# EasyEDA schematic SchematicsEASYEDA.json
TITLE: FLOOD SCHEMATICS; REV: 1.0; Date: 2024-03-15; Sheet: 1/1; Company: THE OHIO STATE UNIVERSITY
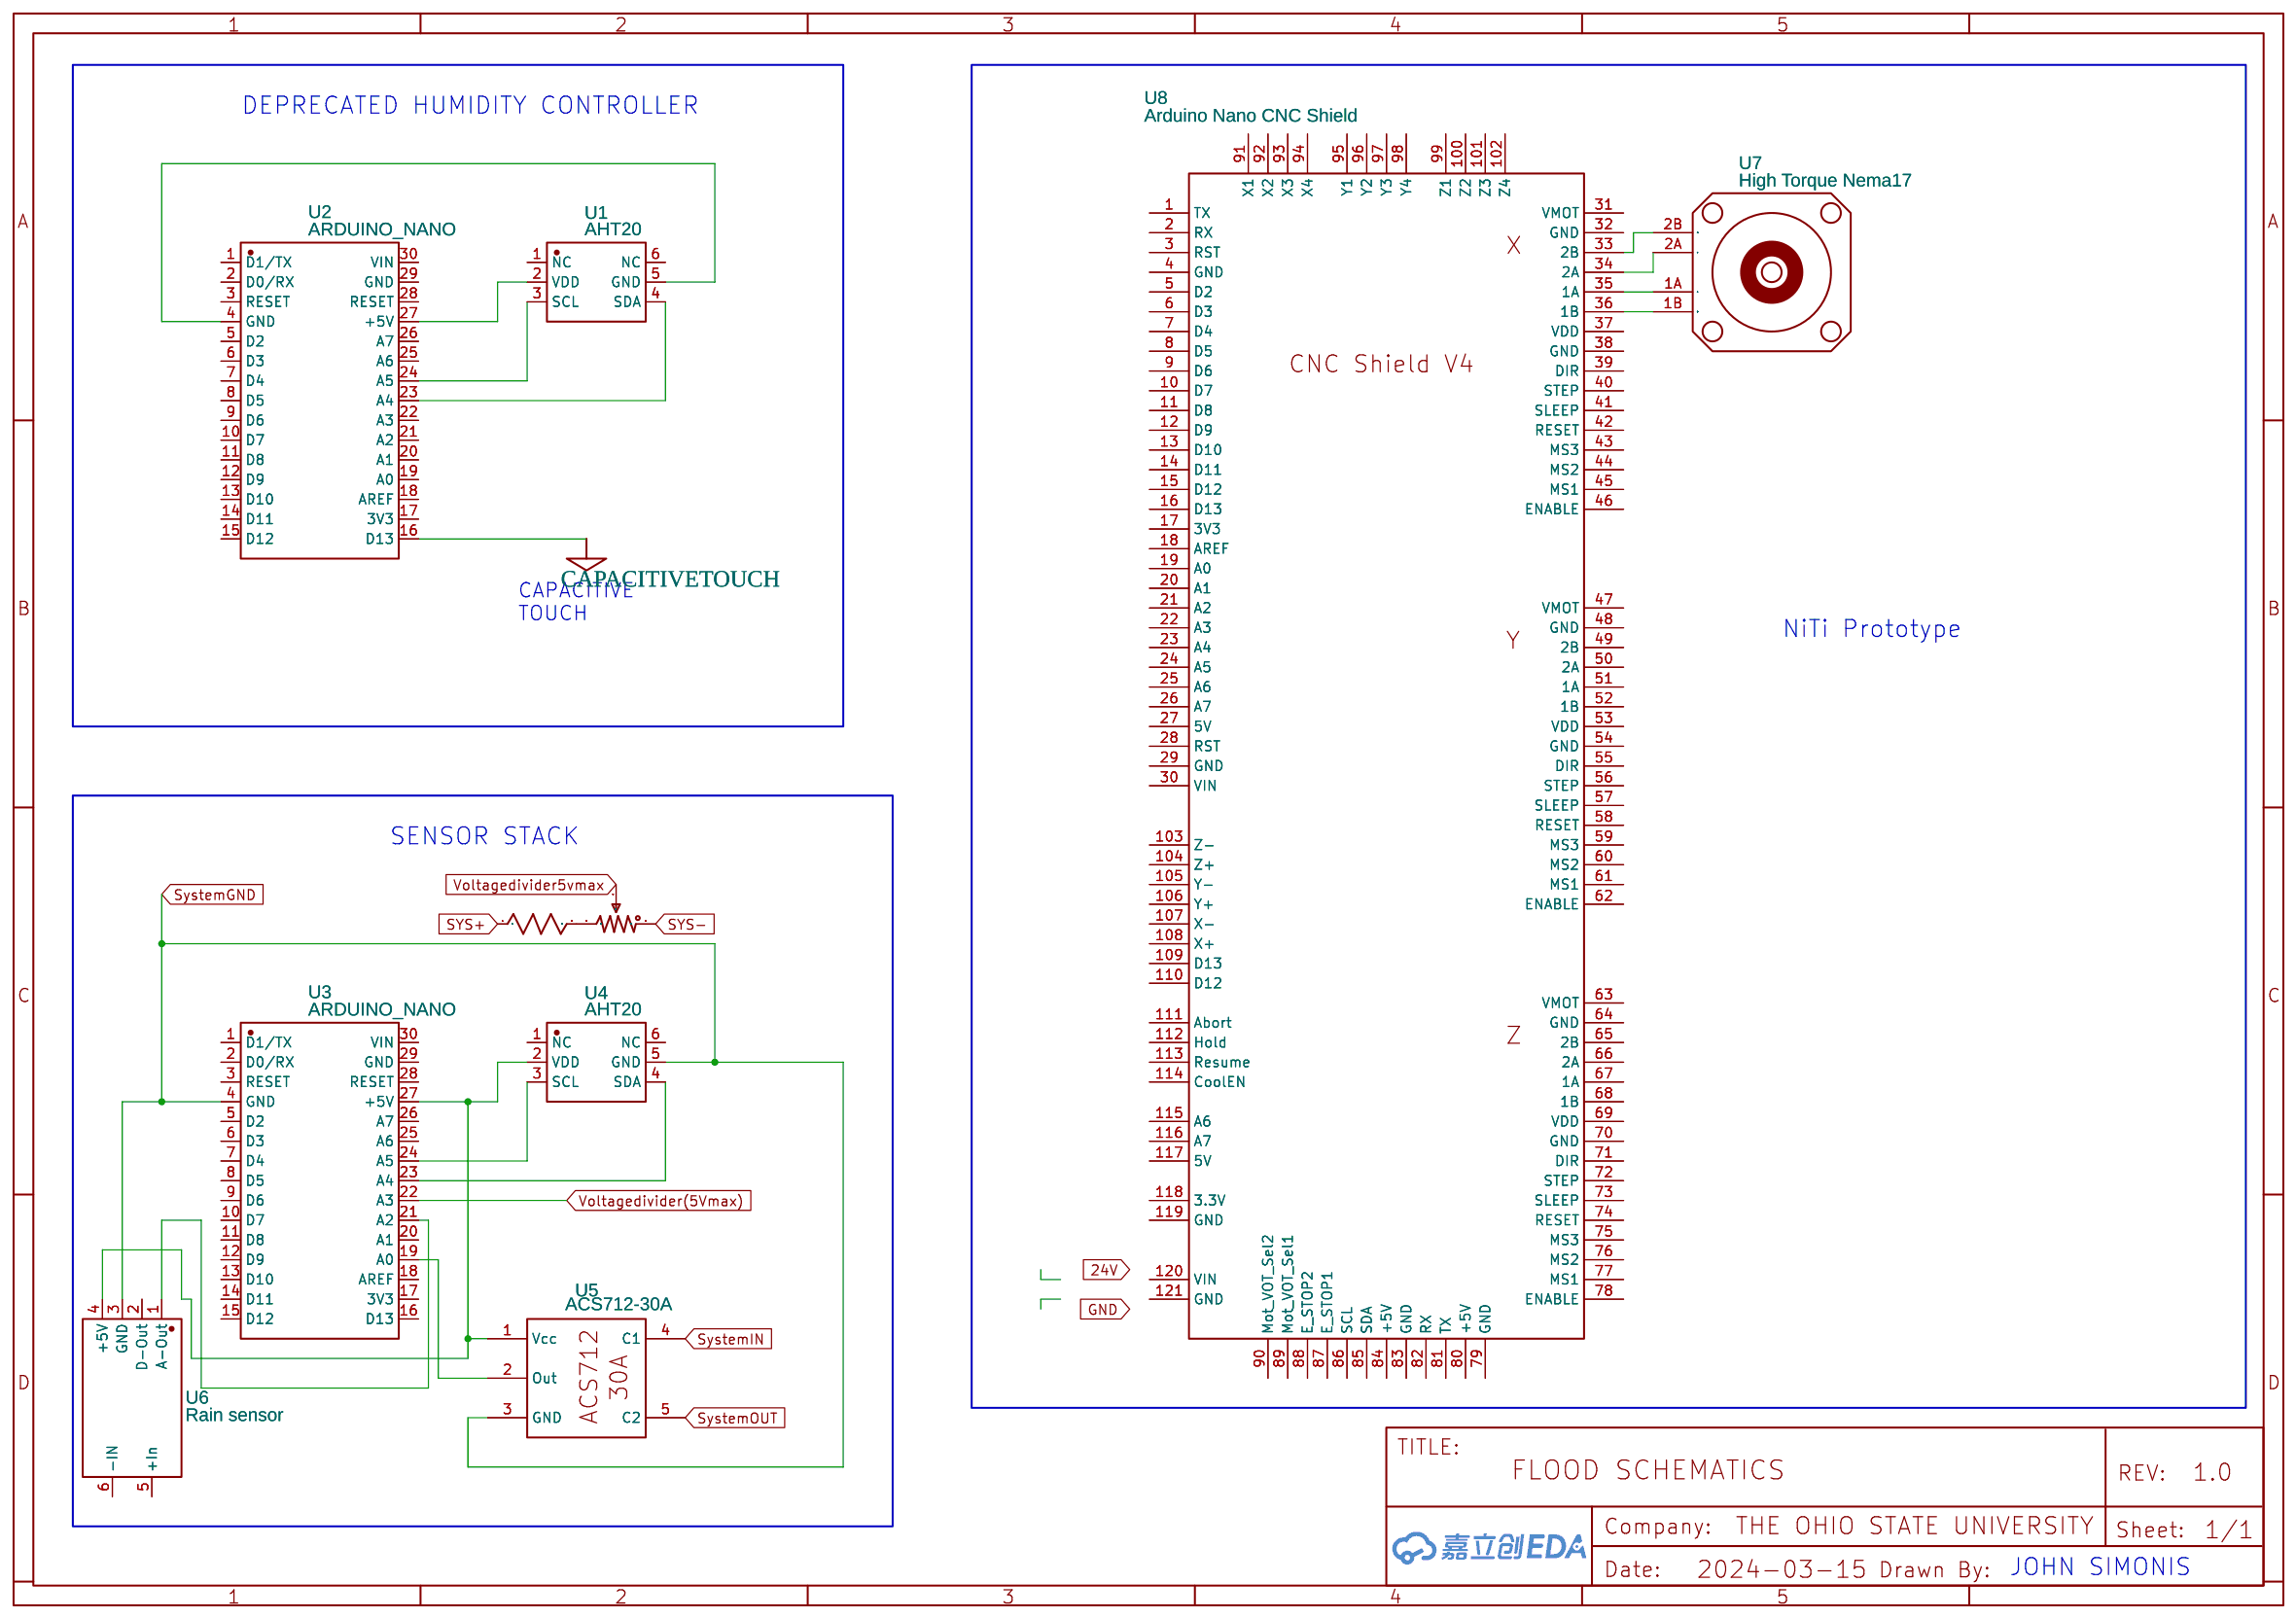
[diagram p0: schematic sheet]

## Parts
R1  1k  [R0603]
RP1  R_3386P_US  [RES-ADJ-TH_3386P]
U1  AHT20  [DFN-6_L3.0-W3.0-P1.00-BL]
U2  ARDUINO_NANO  [COMM-TH_ARDUINO_NANO]
U3  ARDUINO_NANO  [COMM-TH_ARDUINO_NANO]
U4  AHT20  [DFN-6_L3.0-W3.0-P1.00-BL]
U5  ACS712-30A  [ACS712-30A]
U6  Rain sensor  [RAIN SENSOR]
U7  High Torque Nema17  [NEMA17]
U8  Arduino Nano CNC Shield  [ARDUINO NANO CNC SHIELD]

## Library data of the parts
R1 = R_0603_US: Contributor: LCEDA_Lib
RP1 = R_3386P_US: Supplier: LCSC; Contributor: LCEDA_Lib; value(Ω): 10K
U1 U4 = AHT20: Contributor: LCSC; Supplier: LCSC; Supplier Part: C503357; Manufacturer: 广州奥松; JLCPCB Part Class: Extended Part
U2 U3 = ARDUINO_NANO: Contributor: lcsc; Supplier: LCSC; Supplier Part: C9900017879; Manufacturer: null; JLCPCB Part Class: Extended Part
U5 = ACS712-30A: Supplier: Aliexpress; Contributor: mengrie
U6 = Rain sensor: Contributor: Alex_Shaman
U7 = Nema17: Contributor: zaiets_ak20
U8 = Arduino Nano CNC Shield: Contributor: daniar.ormanov2014

## Nets
CAPACITIVETOUCH: U2.16(D13)
SYS+: R1.1
SYS-: RP1.1
SystemGND: U3.4(GND) U4.5(GND) U5.3(GND) U6.3(GND)
SystemIN: U5.4(C1)
SystemOUT: U5.5(C2)
Voltagedivider5vmax: RP1.2
Voltagedivider(5Vmax): U3.22(A3)
Net-(R1-2): R1.2 RP1.3
Net-(U1-2): U1.2(VDD) U2.27(+5V)
Net-(U1-3): U1.3(SCL) U2.24(A5)
Net-(U1-4): U1.4(SDA) U2.23(A4)
Net-(U1-5): U1.5(GND) U2.4(GND)
Net-(U3-19): U3.19(A0) U5.2(Out)
Net-(U3-21): U3.21(A2) U6.1(A-Out)
Net-(U3-23): U3.23(A4) U4.4(SDA)
Net-(U3-24): U3.24(A5) U4.3(SCL)
Net-(U3-27): U3.27(+5V) U4.2(VDD) U5.1(Vcc) U6.4(+5V)
Net-(U7-1A): U7.1A(A) U8.35(1A)
Net-(U7-1B): U7.1B(B) U8.36(1B)
Net-(U7-2A): U7.2A(A) U8.34(2A)
Net-(U7-2B): U7.2B(B) U8.33(2B)

Not connected (* = marked no-connect by the designer): U1 1(NC) 6(NC); U2 1(D1/TX) 2(D0/RX) 3(RESET) 5(D2) 6(D3) 7(D4) 8(D5) 9(D6) 10(D7) 11(D8) 12(D9) 13(D10) 14(D11) 15(D12) 17(3V3) 18(AREF) 19(A0) 20(A1) 21(A2) 22(A3) 25(A6) 26(A7) 28(RESET) 29(GND) 30(VIN); U3 1(D1/TX) 2(D0/RX) 3(RESET) 5(D2) 6(D3) 7(D4) 8(D5) 9(D6) 10(D7) 11(D8) 12(D9) 13(D10) 14(D11) 15(D12) 16(D13) 17(3V3) 18(AREF) 20(A1) 25(A6) 26(A7) 28(RESET) 29(GND) 30(VIN); U4 1(NC) 6(NC); U6 2(D-Out) 5(+In) 6(-IN); U8 1(TX) 2(RX) 3(RST) 4(GND) 5(D2) 6(D3) 7(D4) 8(D5) 9(D6) 10(D7) 11(D8) 12(D9) 13(D10) 14(D11) 15(D12) 16(D13) 17(3V3) 18(AREF) 19(A0) 20(A1) 21(A2) 22(A3) 23(A4) 24(A5) 25(A6) 26(A7) 27(5V) 28(RST) 29(GND) 30(VIN) 31(VMOT) 32(GND) 37(VDD) 38(GND) 39(DIR) 40(STEP) 41(SLEEP) 42(RESET) 43(MS3) 44(MS2) 45(MS1) 46(ENABLE) 47(VMOT) 48(GND) 49(2B) 50(2A) 51(1A) 52(1B) 53(VDD) 54(GND) 55(DIR) 56(STEP) 57(SLEEP) 58(RESET) 59(MS3) 60(MS2) 61(MS1) 62(ENABLE) 63(VMOT) 64(GND) 65(2B) 66(2A) 67(1A) 68(1B) 69(VDD) 70(GND) 71(DIR) 72(STEP) 73(SLEEP) 74(RESET) 75(MS3) 76(MS2) 77(MS1) 78(ENABLE) 79(GND) 80(+5V) 81(TX) 82(RX) 83(GND) 84(+5V) 85(SDA) 86(SCL) 87(E_STOP1) 88(E_STOP2) 89(Mot_VOT_Sel1) 90(Mot_VOT_Sel2) 91(X1) 92(X2) 93(X3) 94(X4) 95(Y1) 96(Y2) 97(Y3) 98(Y4) 99(Z1) 100(Z2) 101(Z3) 102(Z4) 103(Z-) 104(Z+) 105(Y-) 106(Y+) 107(X-) 108(X+) 109(D13) 110(D12) 111(Abort) 112(Hold) 113(Resume) 114(CoolEN) 115(A6) 116(A7) 117(5V) 118(3.3V) 119(GND) 120(VIN) 121(GND)

## Notes on the sheet
- DEPRECATED HUMIDITY CONTROLLER
- CAPACITIVE
  TOUCH
- NiTi Prototype
- SENSOR STACK
- JOHN SIMONIS
